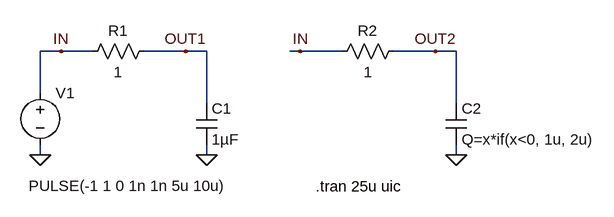
[diagram p0: schematic Fig_2-89_CAP_x-if.asc]
Fig_2-89_CAP_x-if.asc, the LTspice schematic file:
Version 4
SHEET 1 1012 680
WIRE 128 80 96 80
WIRE 176 80 128 80
WIRE 320 80 256 80
WIRE 352 80 320 80
WIRE 496 80 480 80
WIRE 560 80 496 80
WIRE 704 80 640 80
WIRE 736 80 704 80
WIRE 96 144 96 80
WIRE 352 160 352 80
WIRE 736 160 736 80
WIRE 96 240 96 224
WIRE 352 240 352 224
WIRE 736 240 736 224
FLAG 96 240 0
FLAG 352 240 0
FLAG 320 80 OUT1
FLAG 736 240 0
FLAG 704 80 OUT2
FLAG 128 80 IN
FLAG 496 80 IN
SYMBOL voltage 96 128 R0
WINDOW 3 -18 159 Left 2
WINDOW 123 0 0 Left 2
WINDOW 39 0 0 Left 2
SYMATTR Value PULSE(-1 1 0 1n 1n 5u 10u)
SYMATTR InstName V1
SYMBOL res 160 96 R270
WINDOW 0 32 56 VTop 2
WINDOW 3 0 56 VBottom 2
SYMATTR InstName R1
SYMATTR Value 1
SYMBOL cap 336 160 R0
SYMATTR InstName C1
SYMATTR Value 1µF
SYMBOL res 544 96 R270
WINDOW 0 32 56 VTop 2
WINDOW 3 0 56 VBottom 2
SYMATTR InstName R2
SYMATTR Value 1
SYMBOL cap 720 160 R0
SYMATTR InstName C2
SYMATTR Value Q=x*if(x<0, 1u, 2u)
TEXT 520 288 Left 2 !.tran 25u uic

The netlist it stands for:
* Fig_2-89_CAP_x-if.asc
V1 IN 0 PULSE(-1 1 0 1n 1n 5u 10u)
R1 IN OUT1 1
C1 OUT1 0 1µF
R2 IN OUT2 1
C2 OUT2 0 Q=x*if(x<0, 1u, 2u)
.tran 25u uic
.backanno
.end